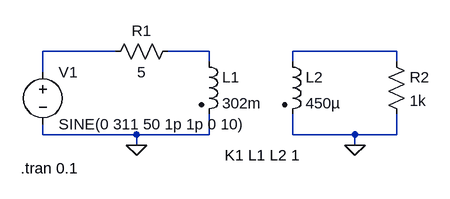
[diagram p0: schematic ej3_parcial_1_1.asc]
ej3_parcial_1_1.asc, the LTspice schematic file:
Version 4
SHEET 1 880 680
WIRE 128 112 16 112
WIRE 272 112 208 112
WIRE 560 112 400 112
WIRE 272 128 272 112
WIRE 400 128 400 112
WIRE 560 128 560 112
WIRE 16 144 16 112
WIRE 16 240 16 224
WIRE 160 240 16 240
WIRE 272 240 272 208
WIRE 272 240 160 240
WIRE 400 240 400 208
WIRE 496 240 400 240
WIRE 560 240 560 208
WIRE 560 240 496 240
WIRE 160 256 160 240
WIRE 496 256 496 240
FLAG 160 256 0
FLAG 496 256 0
SYMBOL voltage 16 128 R0
WINDOW 123 0 0 Left 0
WINDOW 39 0 0 Left 0
SYMATTR InstName V1
SYMATTR Value SINE(0 311 50 1p 1p 0 10)
SYMBOL res 224 96 R90
WINDOW 0 0 56 VBottom 2
WINDOW 3 32 56 VTop 2
SYMATTR InstName R1
SYMATTR Value 5
SYMBOL ind2 256 112 R0
SYMATTR InstName L1
SYMATTR Value 302m
SYMATTR Type ind
SYMBOL ind2 384 112 R0
SYMATTR InstName L2
SYMATTR Value 450µ
SYMATTR Type ind
SYMBOL res 544 112 R0
SYMATTR InstName R2
SYMATTR Value 1k
TEXT 296 272 Left 2 !K1 L1 L2 1
TEXT -18 292 Left 2 !.tran 0.1

The netlist it stands for:
* ej3_parcial_1_1.asc
V1 N001 0 SINE(0 311 50 1p 1p 0 10)
R1 N002 N001 5
L1 N002 0 302m
L2 N003 0 450µ
R2 N003 0 1k
K1 L1 L2 1
.tran 0.1
.backanno
.end